# Altium schematic sheet CAN.SchDoc
size A4
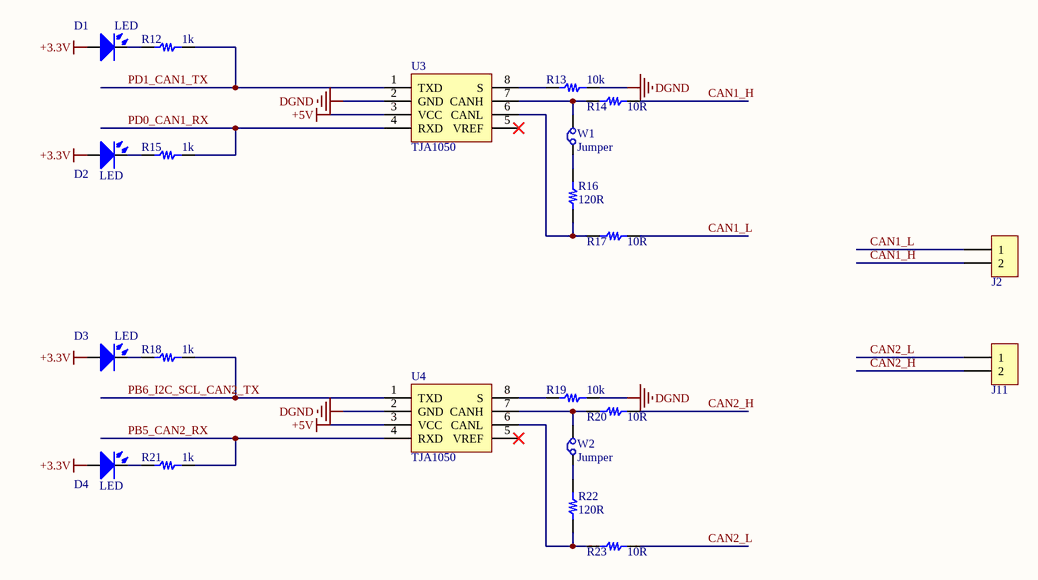
[diagram p0: CAN.SchDoc]

## Parts
D1  LED  [0805-LED-RED]
D2  LED  [0805-LED-RED]
D3  LED  [0805-LED-RED]
D4  LED  [0805-LED-RED]
J2  CON2  [XH2.54-2P]  (value not drawn)
J11  CON2  [XH2.54-2P]  (value not drawn)
R12  1k  [0805_small]
R13  10k  [0805_small]
R14  10R  [0805_small]
R15  1k  [0805_small]
R16  120R  [0805_small]
R17  10R  [0805_small]
R18  1k  [0805_small]
R19  10k  [0805_small]
R20  10R  [0805_small]
R21  1k  [0805_small]
R22  120R  [0805_small]
R23  10R  [0805_small]
U3  TJA1050  [SO-8]
U4  TJA1050  [SO-8]
W1  Jumper  [0603_jump_Pad]
W2  Jumper  [0603_jump_Pad]

## Nets
+3.3V: D1.1(A) D2.1(A) D3.1(A) D4.1(A)
+5V: U3.3(VCC) U4.3(VCC)
DGND: R13.1 R19.1 U3.2(GND) U4.2(GND)
CAN1_H: J2.2 R14.2
CAN1_L: J2.1 R17.2
CAN2_H: J11.2 R20.2
CAN2_L: J11.1 R23.2
PB5_CAN2_RX: R21.1 U4.4(RXD)
PB6_I2C_SCL_CAN2_TX: R18.1 U4.1(TXD)
PD0_CAN1_RX: R15.1 U3.4(RXD)
PD1_CAN1_TX: R12.1 U3.1(TXD)
NetD1_2: D1.2(K) R12.2
NetD2_2: D2.2(K) R15.2
NetD3_2: D3.2(K) R18.2
NetD4_2: D4.2(K) R21.2
NetR13_2: R13.2 U3.8(S)
NetR14_1: R14.1 U3.7(CANH) W1.2(C2)
NetR16_1: R16.1 W1.1(C1)
NetR16_2: R16.2 R17.1 U3.6(CANL)
NetR19_2: R19.2 U4.8(S)
NetR20_1: R20.1 U4.7(CANH) W2.2(C2)
NetR22_1: R22.1 W2.1(C1)
NetR22_2: R22.2 R23.1 U4.6(CANL)

Not connected (* = marked no-connect by the designer): U3 5(VREF)*; U4 5(VREF)*

## Library data of the parts
D1-D4 = LED: Typical INFRARED GaAs LED; Published: 8-Jun-2000; LatestRevisionDate: 08-Jul-2005; LatestRevisionNote: Mech Layer 1 removed.; PackageReference: LED-0; Publisher: Altium Limited; PackageDescription: LED; 2 Leads
J2 J11 = CON2: Connector
R12-R23 = Res: 电阻; Value: 230k; Published: 24-Mar-1999; LatestRevisionDate: 29-May-2009; LatestRevisionNote: IPC-7351 Footprint Added.; PackageVersion: Mar-2003; PackageReference: 6-0805; Publisher: Altium Limited; PackageDescription: Chip Resistor 0805 Case Size; Code_IPC: RESC2012
W1 W2 = Jumper: Jumper Wire; Published: 24-Mar-1999; LatestRevisionDate: 17-Jul-2002; LatestRevisionNote: Re-released for DXP Platform.; PackageReference: RAD-0.2; Publisher: Altium Limited; PackageDescription: Radial Cap, Thru-Hole; 2 Leads; 0.2 in Pin Spacing